# EAGLE design BATT_CONNECTOR (EAGLE 9.6.2)
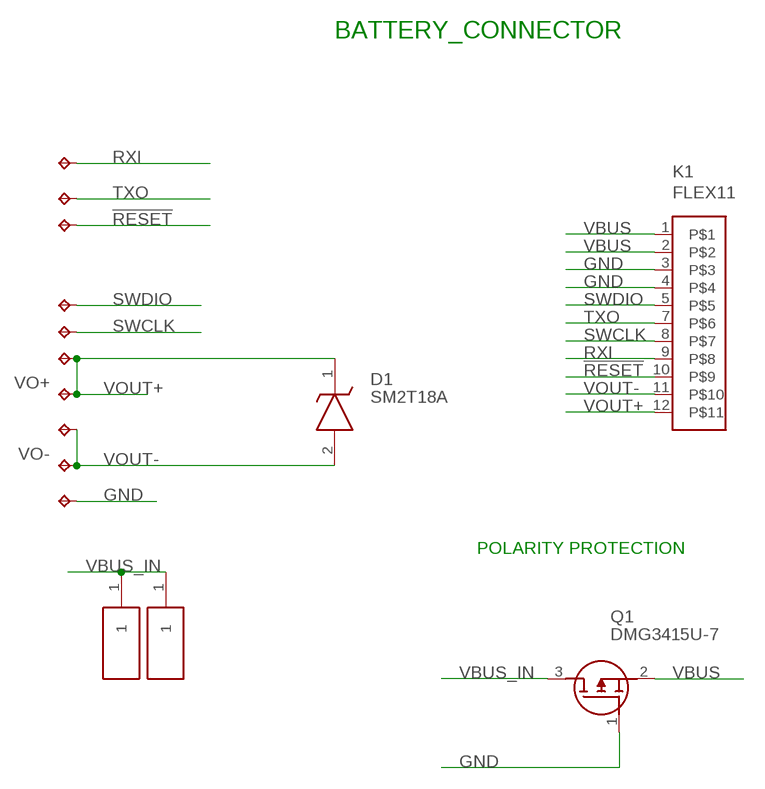
[diagram p0: schematic, sheet 1]

## Parts
!RESET  TPB2,54  [B2,54]
D1  SM2T18A  [SM2T18A]
GND  TPB2,54  [B2,54]
H1  S1761-42R  [S176142R]
H2  S1761-42R  [S176142R]
K1  FLEX11  [FLEX11]
Q1  DMG3415U-7  SSM3J338R,LF  [SSM3J332RLFT]
RXI  TPB2,54  [B2,54]
SWCLK  TPB2,54  [B2,54]
SWDIO  TPB2,54  [B2,54]
TXO  TPB2,54  [B2,54]
VO+  TPB2,54  [B2,54]
VO-  TPB2,54  [B2,54]
VOUT+1  TPB2,54  [B2,54]
VOUT-1  TPB2,54  [B2,54]

## Nets
!RESET: !RESET.TP K1.10
GND: GND.TP K1.3 K1.4 Q1.1(G)
RXI: K1.9 RXI.TP
SWCLK: K1.8 SWCLK.TP
SWDIO: K1.5 SWDIO.TP
TXO: K1.7 TXO.TP
VBUS: K1.1 K1.2 Q1.2(S)
VBUS_IN: H1.1 H2.1 Q1.3(D)
VOUT+: D1.1(K) K1.12 VO+.TP VOUT+1.TP
VOUT-: D1.2(A) K1.11 VO-.TP VOUT-1.TP

## Notes on the sheet
- BATTERY_CONNECTOR
- POLARITY PROTECTION

## Library data of the parts
!RESET GND RXI SWCLK SWDIO TXO VO+ VO- VOUT+1 VOUT-1 = testpad:TP: Test pad
D1 = SM2T18A:SM2T18A: 200 W TVS in STmite Source: Datasheet <https://www.st.com/resource/en/datasheet/sm2t.pdf>; DESCRIPTION: 200 W TVS in STmite; HEIGHT: 1.15mm; MANUFACTURER_NAME: STMicroelectronics; MANUFACTURER_PART_NUMBER: SM2T18A; MOUSER_PART_NUMBER: 511-SM2T18A; MOUSER_PRICE-STOCK: https://www.mouser.co.uk/ProductDetail/STMicroelectronics/SM2T18A?qs=9NrABl3fj%2FoQ9e7jVf8sKA%3D%3D
H1 H2 = S1761-42R:S1761-42R: EZ_Boardware SMT Spring Contact 3.5mm Source: Datasheet <https://cdn.harwin.com/pdfs/S1761-XXR.pdf>; DESCRIPTION: EZ_Boardware SMT Spring Contact 3.5mm; HEIGHT: 3.8mm; MANUFACTURER_NAME: Harwin; MANUFACTURER_PART_NUMBER: S1761-42R; MOUSER_PART_NUMBER: 855-S1761-42R; MOUSER_PRICE-STOCK: https://www.mouser.co.uk/ProductDetail/Harwin/S1761-42R?qs=ulE8k0yEMYZkmoaxRCFkSQ%3D%3D
K1 = Flex_3mm:FLEX11
Q1 = SSM3J338R_LF:SSM3J338R,LF: MOSFET Small-signal MOSFET Vdss= -12V, ID= -6A Source: Datasheet <http://toshiba.semicon-storage.com/info/docget.jsp?did=30384&prodName=SSM3J338R>; ARROW_PART_NUMBER: SSM3J338R,LF; ARROW_PRICE-STOCK: https://www.arrow.com/en/products/ssm3j338rlf/toshiba?region=nac; DESCRIPTION: MOSFET Small-signal MOSFET Vdss= -12V, ID= -6A; HEIGHT: mm; MANUFACTURER_NAME: Toshiba; MANUFACTURER_PART_NUMBER: SSM3J338R,LF; MOUSER_PART_NUMBER: 757-SSM3J338RLF; MOUSER_PRICE-STOCK: https://www.mouser.co.uk/ProductDetail/Toshiba/SSM3J338RLF?qs=lhkzy8lC%252BSvURFM9ZjmJSw%3D%3D

## Board
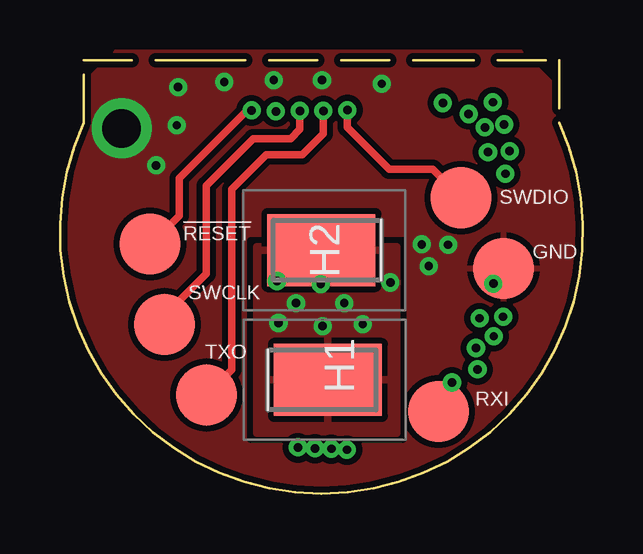
[diagram p1: board, top side]
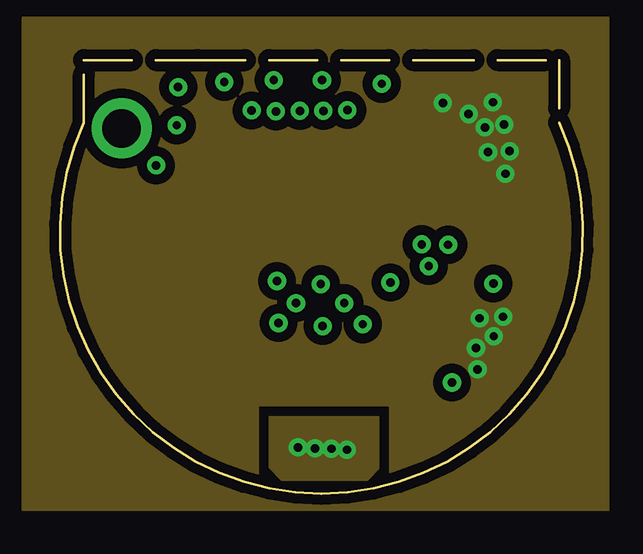
[diagram p2: board, inner layer Route2]
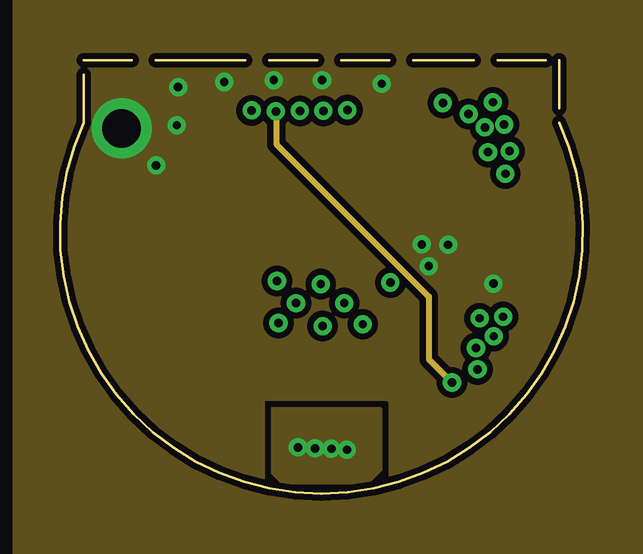
[diagram p3: board, inner layer Route15]
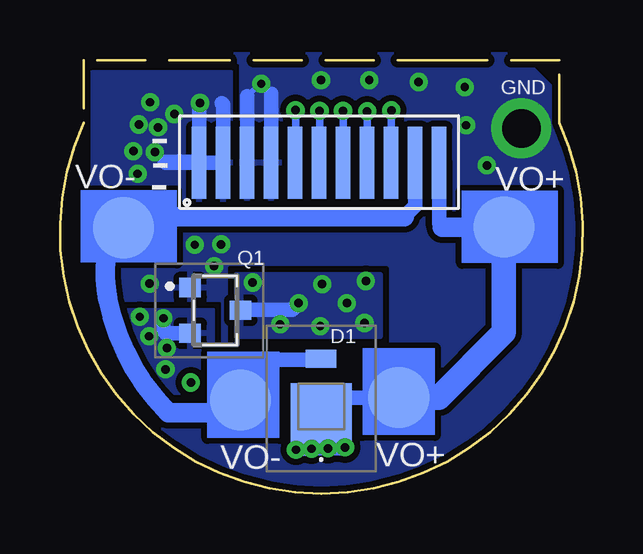
[diagram p4: board, bottom side, seen from below]

Size 21.79 x 18.07 mm. Coordinates in mm from the lower left corner, seen from the top.
Outline: 20.79,18.07 20.79,15.46 arc-229 0.99,15.46 0.99,18.07 5.73,18.07 5.71,18.06 15.21,18.06 15.23,18.07 20.79,18.07
Copper layers (1+2*15+16): Top 0.035mm / dielectric 1.5mm / Route2 0.035mm / dielectric 0.15mm / Route15 0.035mm / dielectric 0.2mm / Bottom 0.035mm
Design rules "default *": minimum track width 0.00038125mm, minimum drill 0.35mm, track to track 8mil, track to pad 8mil, pad to pad 8mil, via to via 8mil, smd to smd 5mil, copper to edge 8mil, drill to drill 8mil, minimum pad ring 10mil, minimum via ring 8mil, stop-mask expansion 2mil, vias tented up to drill 50mil, thermal gap 10mil
bRestrict: area 21,9.5 to 21.7,12.6

### Footprints (pad centres in the part's own frame; a part is rotated, then mirrored left to right if it is on the bottom)
B2,54 = smd 2.54 x 2.54: TP 0,0
SM2T18A = smd 2.67 x 2.54: 1 -0.698,0 | smd 0.762 x 1.27: 2 1.653,0
S176142R = smd 3 x 4.5: 1 0,-2
FLEX11 = smd 0.6 x 3: 1 0.8,2.05; 2 1.8,2.05; 3 2.8,2.05; 4 3.8,2.05; 5 4.8,2.05; 7 5.8,2.05; 8 6.8,2.05; 9 7.8,2.05; 10 8.8,2.05; 11 9.8,2.05; 12 10.8,2.05
SSM3J332RLFT = smd 0.8 x 0.9: 1 -0.95,-1.05; 2 0.95,-1.05; 3 0,1.05

### Placement (x,y rotation side)
!RESET  3.74,10.41 0 top
D1  10.9,3.97 90 bottom
GND  18.48,9.39 0 top
H1  13.16,4.74 270 top
H2  8.89,10.15 90 top
K1  16.79,11.73 0 bottom
Q1  15.31,7.64 270 bottom
RXI  15.77,3.42 0 top
SWCLK  4.35,7.05 0 top
SWDIO  16.7,12.33 0 top
TXO  6.1,4.11 0 top
VO+  3.29,11.11 0 bottom
VO-  19.13,11.08 0 bottom
VOUT+1  7.67,4 0 bottom
VOUT-1  14.27,3.9 0 bottom

### Tracks (layer width: path | path; a pad name or v marks a point on that pad's centre or on a via)
!RESET  (via drill 0.35)
  Top 0.305: !RESET.TP 3.8,10.41 4.97,11.58 4.97,13.15 7.79,15.97 v7.98,15.97
  Bottom 0.203: K1.10
  Bottom 0.305: v7.98,15.97 K1.10
GND  (via drill 0.35, 1.6 pad 2.5)
  Bottom 0.203: 12.99,16.67 v13.4,17.08 13.47,17.08 13.99,16.56
  Bottom 0.61: 12.99,16.67 K1.4 | 13.99,16.56 K1.3
  other vias: 6.84,17.15 4,13.68 15.07,10.39 16.17,10.37 18.05,8.75 15.36,9.48 4.86,15.35 4.92,16.94 8.9,17.23 10.91,17.23 2.56,15.22
  pour Bottom (isolate 0.254, rank 2): 2.66,18.32 19.36,18.32 22.17,15.51 22.17,-0.48 2.16,-0.48 -1.44,3.12 -1.44,14.22
  pour Top (isolate 0.254, rank 2): 2.29,18.46 19.22,18.46 22.96,14.72 22.96,5.7 16.98,-0.28 3.36,-0.28 -1.32,4.4 -1.32,14.85
  pour Bottom (isolate 0.305): 3.46,17.82 3.46,11.91 6.66,11.91 6.66,17.82
  pour Route15 (isolate 0.254, rank 2): -1.94,20.62 -1.94,-2.48 25.06,-2.48 25.06,20.62
RXI  (via drill 0.35)
  Top 0.61: RXI.TP 15.77,4.07 v16.33,4.63
  Route15 0.203: v8.99,15.93 9.01,15.91
  Route15 0.254: v16.33,4.63 15.36,5.6 15.36,8.21 9.01,14.56 9.01,15.91
  Bottom 0.203: v8.99,15.93
  Bottom 0.305: K1.9 v8.99,15.93
SWCLK  (via drill 0.35)
  Top 0.254: SWCLK.TP 4.35,7.44
  Top 0.305: 4.35,7.44 6.08,9.17 6.08,12.82 8.05,14.79 9.6,14.79 9.99,15.18 v9.99,15.95
  Bottom 0.305: v9.99,15.95 K1.8
SWDIO  (via drill 0.35)
  Top 0.305: v11.97,15.98 11.97,15.26 13.72,13.51 15.52,13.51 SWDIO.TP
  Top 0.406: 16.1,12.33 SWDIO.TP
  Bottom 0.203: 11.97,13.8 K1.5
  Bottom 0.305: v11.97,15.98 11.97,13.8
TXO  (via drill 0.35)
  Top 0.305: TXO.TP 7.15,5.16 7.15,12.69 8.58,14.12 10.1,14.12 10.97,15 v10.97,15.95
  Bottom 0.203: 10.97,13.8 K1.7
  Bottom 0.305: v10.97,15.95 10.97,13.8
VBUS  (via drill 0.35)
  Bottom 0.406: 17.37,6.69 17.48,6.8
  Bottom 0.61: Q1.2 17.37,6.69 | 17.48,6.8 v17.48,7.31 | 15.04,16.26 14.99,16.21 K1.2 17.38,13.78 17.42,13.82 16.03,13.82 K1.1 15.99,16.24 v15.95,16.28
  other vias: 18.03,16.31 17.02,15.82 17.83,14.23 18.73,14.27 18.5,15.38 18.07,6.56 18.46,7.37 17.33,6.07 17.39,5.18 18.55,13.33 17.7,15.26
  pour Route2 (isolate 0.406, rank 2): -1.57,19.82 -1.57,-0.68 22.87,-0.68 22.87,19.82
  pour Bottom: 14.63,17.62 14.63,12.13 20.46,12.13 20.46,17.62
  pour Bottom (isolate 0.254): 15.38,7.71 15.38,4.15 19.16,4.15 19.16,7.71
VBUS_IN  (via drill 0.35)
  Bottom 0.406: Q1.3 14.23,7.67
  Bottom 0.61: v11.84,7.94 12.11,7.67 14.23,7.67
  other vias: 10.94,6.98 9.83,7.94 9.1,7.11 12.61,7.06 10.86,8.73 9.04,8.86 13.76,8.8
  pour Top: 8.2,10.29 14.02,10.29 14.02,2.51 8.2,2.51
  pour Bottom: 8.42,9.17 14.46,9.17 14.46,6.52 8.43,6.52 8.4,6.55 8.4,9.15
VOUT+  (via drill 0.35)
  Bottom 0.406: 10.18,4 D1.1
  Bottom 0.61: VOUT+1.TP 10.18,4 | 5.85,11.11 5.99,11.25 K1.12 | D1.1 10.9,2.17 v10.62,1.89 | v10.62,1.89 9.95,1.89 v9.91,1.93 | v10.62,1.89 11.28,1.89 v11.3,1.87 11.91,1.87 v11.95,1.83
  Bottom 0.813: VO+.TP 5.85,11.11
  Bottom 1.016: VOUT+1.TP 6.01,4 3.29,6.72 VO+.TP
  pour Route2 (isolate 0.254): 8.71,1.1 9.22,0.59 12.81,0.59 13.27,1.05 13.27,3.19 8.71,3.19
  pour Route15 (isolate 0.254): 8.82,3.58 8.82,0.85 9.21,0.46 9.24,0.43 12.57,0.43 12.83,0.43 13.4,1 13.4,3.52 13.37,3.55 8.85,3.55
VOUT-
  Bottom 0.152: 19.05,11.16 VO-.TP 19.17,11.12 19.56,11.12
  Bottom 0.406: VOUT-1.TP 14.27,5.57 | D1.2 10.96,5.57
  Bottom 0.61: VO-.TP 17.7,11.08 17.24,11.54 | 14.27,5.57 10.96,5.57 | K1.11 6.99,11.99 7.44,11.54
  Bottom 0.813: VOUT-1.TP 14.79,3.38 17.27,3.38 arc34 19.8,8.09 arc32 19.56,11.12 | 7.44,11.54 17.24,11.54
  Bottom 1.016: 19.14,10.45 19.13,10.46 VO-.TP
(copper drawn outside any net)
  shapes: Bottom area x4

### Text on the board
bNames: GND | - | - | - | VO+ | VO-